# Altium schematic sheet demoboard.SchDoc
size A3; PageSetup: Record=PageOptions|CenterHorizontal=True|CenterVertical=True|PrintScale=0.73|XCorrection=1.00|YCorrection=1.00|PrintKind=0|BorderSize=5000000|LeftOffset=0|BottomOffset=0|Orientation=2|PaperLength=1000|PaperWidth=1000|Scale=100|PaperSource=7|PrintQuality=-3|MediaType=1|DitherType=10|PrintScaleMode=1|PaperKind=A4|PaperIndex=9
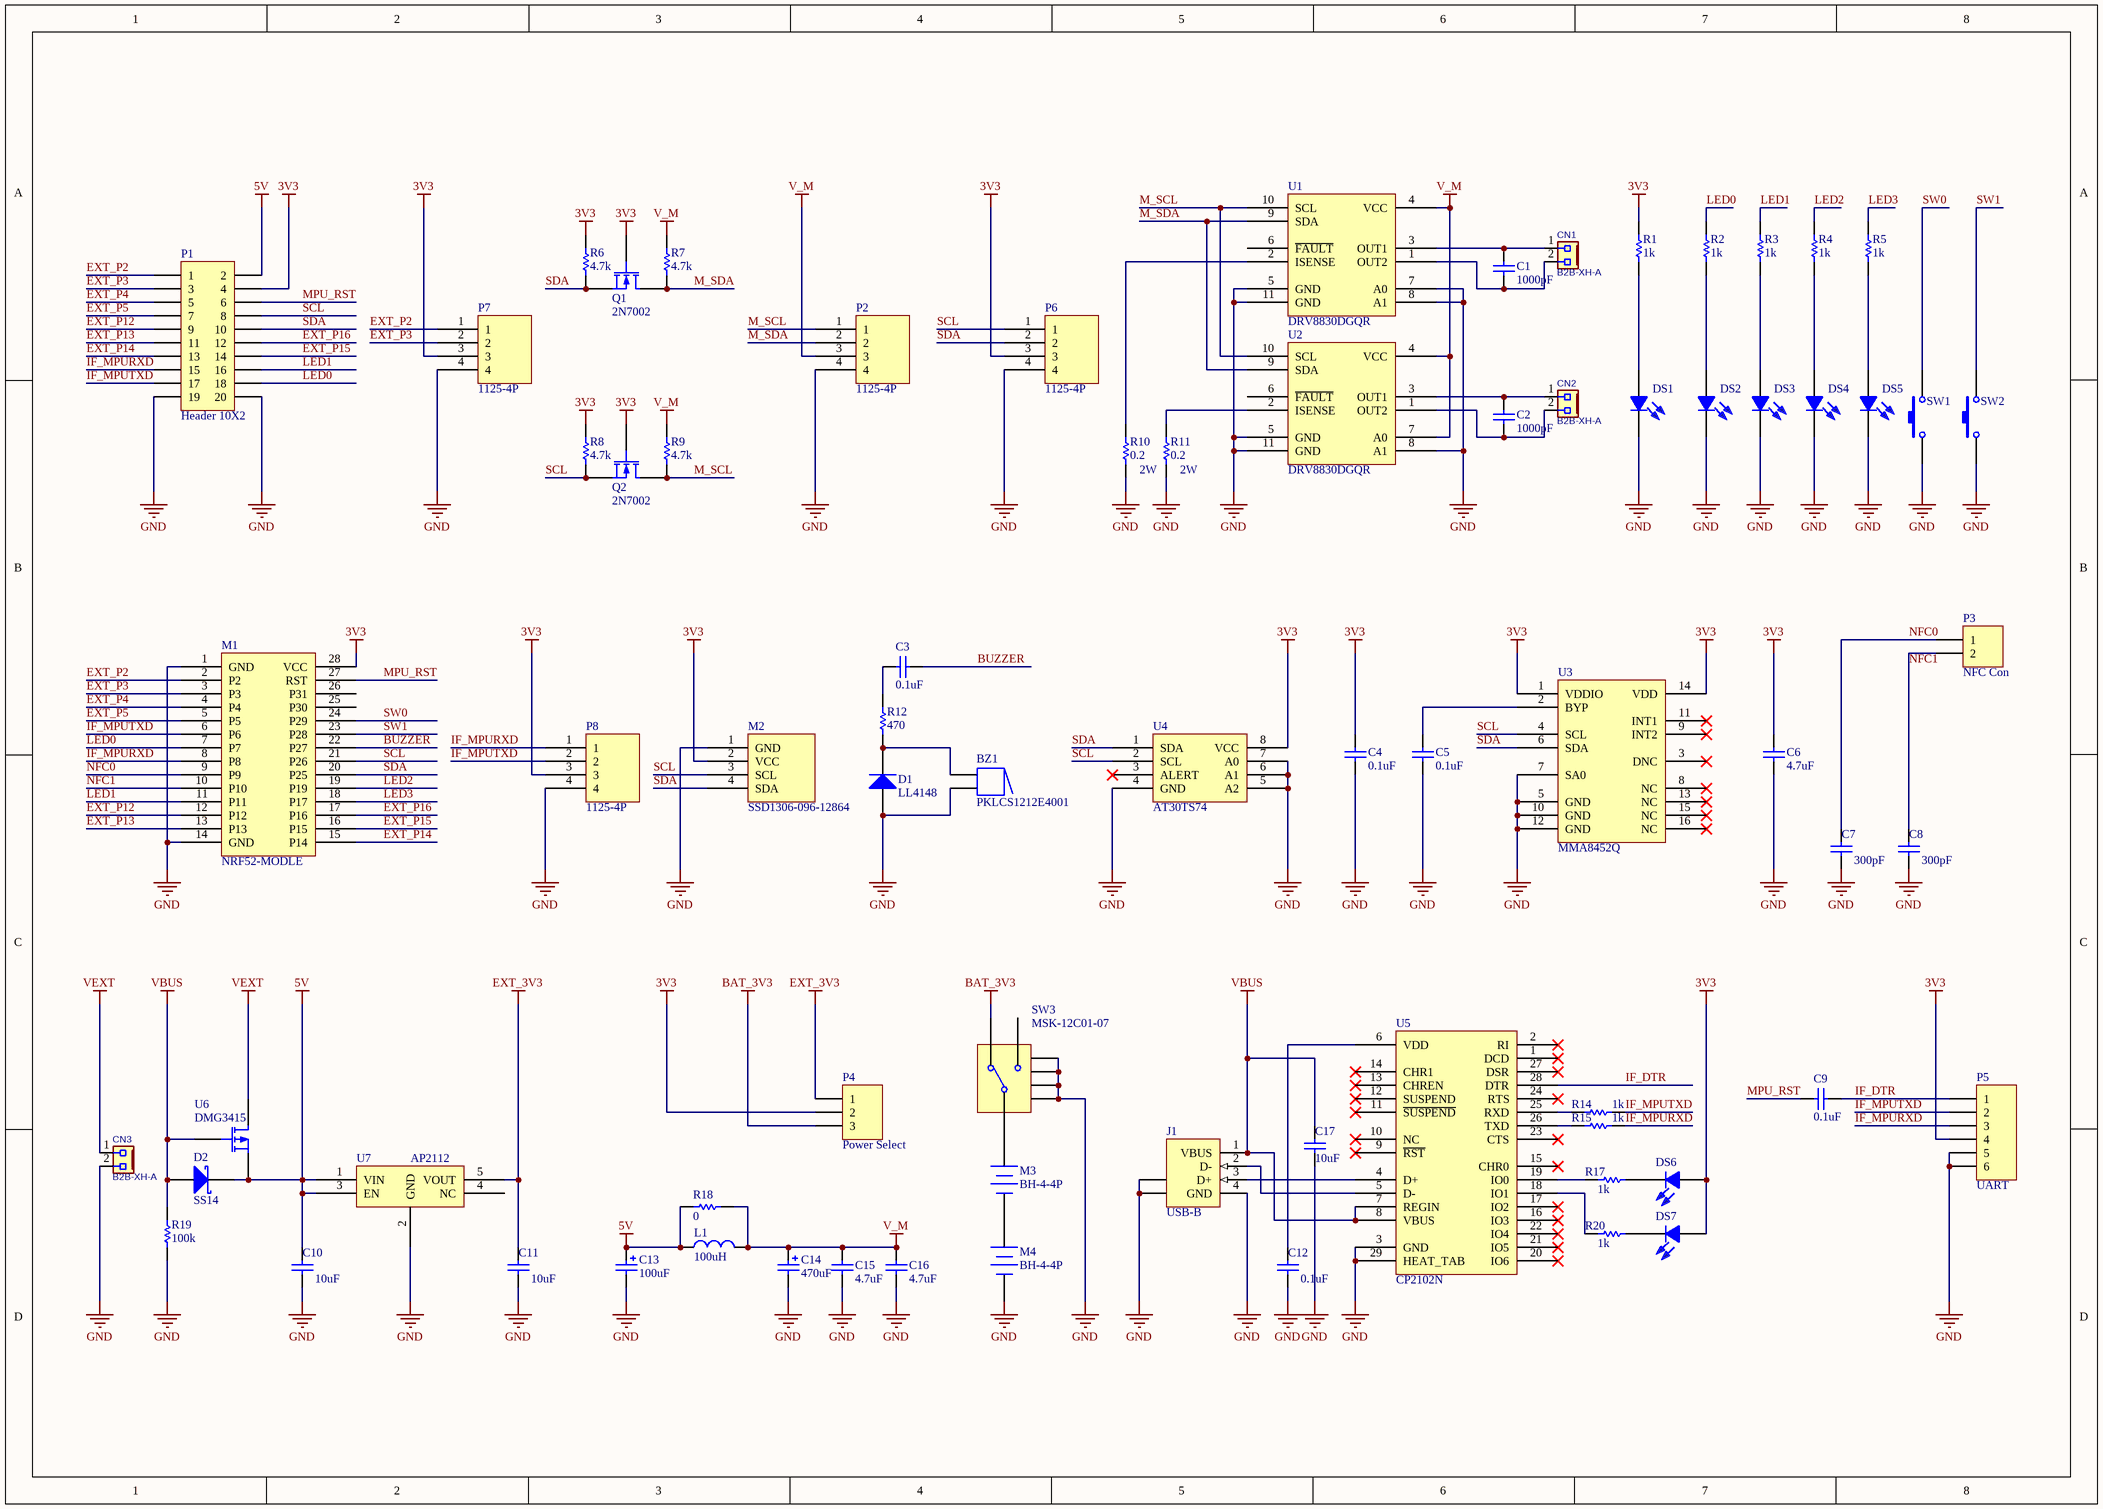
[diagram p0: demoboard.SchDoc]

## Parts
BZ1  PKLCS1212E4001  [PKLCS1212E4001]
C1  value 1000pF  [2012[0805]]  (hidden comment: Cap1)
C2  value 1000pF  [2012[0805]]  (hidden comment: Cap1)
C3  value 0.1uF  [2012[0805]]  (hidden comment: Cap1)
C4  value 0.1uF  [2012[0805]]  (hidden comment: Cap1)
C5  value 0.1uF  [2012[0805]]  (hidden comment: Cap1)
C6  value 4.7uF  [2012[0805]]  (hidden comment: Cap1)
C7  value 300pF  [2012[0805]]  (hidden comment: Cap1)
C8  value 300pF  [2012[0805]]  (hidden comment: Cap1)
C9  value 0.1uF  [2012[0805]]  (hidden comment: Cap1)
C10  value 10uF  [2012[0805]]  (hidden comment: Cap1)
C11  value 10uF  [2012[0805]]  (hidden comment: Cap1)
C12  value 0.1uF  [2012[0805]]  (hidden comment: Cap1)
C13  value 100uF  [CE04-8]  (hidden comment: Cap2)
C14  value 470uF  [CE04-8]  (hidden comment: Cap2)
C15  value 4.7uF  [2012[0805]]  (hidden comment: Cap1)
C16  value 4.7uF  [2012[0805]]  (hidden comment: Cap1)
C17  value 10uF  [2012[0805]]  (hidden comment: Cap1)
CN1  B2B-XH-A  [CND-B2B-XH-A]
CN2  B2B-XH-A  [CND-B2B-XH-A]
CN3  B2B-XH-A  [CND-B2B-XH-A]
D1  LL4148  [SOD80]
D2  SS14  [DO-214AC]
DS1  (no value)  [3216[1206]+A]
DS2  (no value)  [3216[1206]+A]
DS3  (no value)  [3216[1206]+A]
DS4  (no value)  [3216[1206]+A]
DS5  (no value)  [3216[1206]+A]
DS6  (no value)  [3216[1206]+A]
DS7  (no value)  [3216[1206]+A]
J1  USB-B  [USB-B-MICRO]
L1  value 100uH  [INDUCTOR-1212]  (hidden comment: Inductor)
M1  NRF52-MODLE  [NRF52-MODLE]
M2  SSD1306-096-12864  [SSD1306-096-12864]
M3  BH-4-4P  [BH-4-4P]
M4  BH-4-4P  [BH-4-4P]
P1  Header 10X2  [HDR2X10]
P2  1125-4P  [1125-4P]
P3  NFC Con  [HDR1X2]
P4  Power Select  [HDR1X3]
P5  UART  [HDR1X6]
P6  1125-4P  [1125-4P]
P7  1125-4P  [1125-4P]
P8  1125-4P  [1125-4P]
Q1  2N7002  [SOT23-3]
Q2  2N7002  [SOT23-3]
R1  value 1k  [2012[0805]]  (hidden comment: Res)
R2  value 1k  [2012[0805]]  (hidden comment: Res)
R3  value 1k  [2012[0805]]  (hidden comment: Res)
R4  value 1k  [2012[0805]]  (hidden comment: Res)
R5  value 1k  [2012[0805]]  (hidden comment: Res)
R6  value 4.7k  [2012[0805]]  (hidden comment: Res)
R7  value 4.7k  [2012[0805]]  (hidden comment: Res)
R8  value 4.7k  [2012[0805]]  (hidden comment: Res)
R9  value 4.7k  [2012[0805]]  (hidden comment: Res)
R10  value 0.2  [6332[2512]]  (hidden comment: Res)
R11  value 0.2  [6332[2512]]  (hidden comment: Res)
R12  value 470  [2012[0805]]  (hidden comment: Res)
R14  value 1k  [2012[0805]]  (hidden comment: Res)
R15  value 1k  [2012[0805]]  (hidden comment: Res)
R17  value 1k  [2012[0805]]  (hidden comment: Res)
R18  value 0  [2012[0805]]  (hidden comment: Res)
R19  value 100k  [2012[0805]]  (hidden comment: Res)
R20  value 1k  [2012[0805]]  (hidden comment: Res)
SW1  TL3342F160QG  [TL3342F160QG]  (value not drawn)
SW2  TL3342F160QG  [TL3342F160QG]  (value not drawn)
SW3  MSK-12C01-07  [MSK-12C01-07]
U1  DRV8830DGQR  [MSOP10TPH]
U2  DRV8830DGQR  [MSOP10TPH]
U3  MMA8452Q  [QFN16S-0.5]
U4  AT30TS74  [SOIC8]
U5  CP2102N  [QFN28-0.5]
U6  DMG3415  [SOT23-3]
U7  AP2112  [SOT23-5]

## Nets
3V3: C4.1 C6.1 DS6.1 DS7.1 M1.28(VCC) M2.2(VCC) P1.4 P4.2 P5.4 P6.3 P7.3 P8.3 Q1.1(G) Q2.1(G) R1.1 R6.1 R8.1 U3.1(VDDIO) U3.14(VDD) U4.8(VCC)
5V: C10.2 C13.1 D2.2(K) L1.1 P1.2 R18.1 U6.2(S) U7.1(VIN) U7.3(EN)
BAT_3V3: P4.3 SW3.1
EXT_3V3: C11.2 P4.1 U7.5(VOUT)
GND: BZ1.2 C4.2 C5.2 C6.2 C7.1 C8.1 C10.1 C11.1 C12.1 C13.2 C14.2 C15.2 C16.2 C17.1 CN3.2 D1.1(A) DS1.2 DS2.2 DS3.2 DS4.2 DS5.2 J1.4(GND) J1.5(SHLD) J1.6(SHLD) M1.1(GND) M1.14(GND) M2.1(GND) M4.2(-) P1.19 P1.20 P2.4 P5.5 P5.6 P6.4 P7.4 P8.4 R10.1 R11.1 R19.1 SW1.1 SW2.1 SW3.4 SW3.5 SW3.6 SW3.7 U1.5(GND) U1.7(A0) U1.8(A1) U1.11(GND) U2.5(GND) U2.8(A1) U2.11(GND) U3.5(GND) U3.7(SA0) U3.10(GND) U3.12(GND) U4.4(GND) U4.5(A2) U4.6(A1) U4.7(A0) U5.3(GND) U5.29(HEAT_TAB) U7.2(GND)
V_M: C14.1 C15.1 C16.1 L1.2 P2.3 R7.2 R9.2 R18.2 U1.4(VCC) U2.4(VCC) U2.7(A0)
VBUS: C17.2 D2.1(A) J1.1(VBUS) R19.2 U5.7(REGIN) U5.8(VBUS) U6.1(G)
VEXT: CN3.1 U6.3(D)
BUZZER: C3.2 M1.22(P27)
EXT_P2: M1.2(P2) P1.1 P7.1
EXT_P3: M1.3(P3) P1.3 P7.2
EXT_P4: M1.4(P4) P1.5
EXT_P5: M1.5(P5) P1.7
EXT_P12: M1.12(P12) P1.9
EXT_P13: M1.13(P13) P1.11
EXT_P14: M1.15(P14) P1.13
EXT_P15: M1.16(P15) P1.14
EXT_P16: M1.17(P16) P1.12
IF_DTR: C9.1 P5.1 U5.28(DTR)
IF_MPURXD: M1.8(P8) P1.15 P5.3 P8.1 R15.2
IF_MPUTXD: M1.6(P6) P1.17 P5.2 P8.2 R14.2
LED0: M1.7(P7) P1.18 R2.1
LED1: M1.11(P11) P1.16 R3.1
LED2: M1.19(P19) R4.1
LED3: M1.18(P17) R5.1
M_SCL: P2.1 Q2.3(D) R9.1 U1.10(SCL) U2.10(SCL)
M_SDA: P2.2 Q1.3(D) R7.1 U1.9(SDA) U2.9(SDA)
MPU_RST: C9.2 M1.27(RST) P1.6
NFC0: C7.2 M1.9(P9) P3.1
NFC1: C8.2 M1.10(P10) P3.2
SCL: M1.21(P26) M2.3(SCL) P1.8 P6.1 Q2.2(S) R8.2 U3.4(SCL) U4.2(SCL)
SDA: M1.20(P25) M2.4(SDA) P1.10 P6.2 Q1.2(S) R6.2 U3.6(SDA) U4.1(SDA)
SW0: M1.24(P29) SW1.3
SW1: M1.23(P28) SW2.3
NetBZ1_1: BZ1.1 D1.2(K) R12.1
NetC1_1: C1.1 CN1.1 U1.3(OUT1)
NetC1_2: C1.2 CN1.2 U1.1(OUT2)
NetC2_1: C2.1 CN2.1 U2.3(OUT1)
NetC2_2: C2.2 CN2.2 U2.1(OUT2)
NetC3_1: C3.1 R12.2
NetC5_1: C5.1 U3.2(BYP)
NetC12_2: C12.2 U5.6(VDD)
NetDS1_1: DS1.1 R1.2
NetDS2_1: DS2.1 R2.2
NetDS3_1: DS3.1 R3.2
NetDS4_1: DS4.1 R4.2
NetDS5_1: DS5.1 R5.2
NetDS6_2: DS6.2 R17.1
NetDS7_2: DS7.2 R20.1
NetJ1_2: J1.2(D-) U5.5(D-)
NetJ1_3: J1.3(D+) U5.4(D+)
NetM3_1: M3.1(+) SW3.2
NetM3_2: M3.2(-) M4.1(+)
NetR10_2: R10.2 U1.2(ISENSE)
NetR11_2: R11.2 U2.2(ISENSE)
NetR14_1: R14.1 U5.25(RXD)
NetR15_1: R15.1 U5.26(TXD)
NetR17_2: R17.2 U5.19(IO0)
NetR20_2: R20.2 U5.18(IO1)

Not connected (* = marked no-connect by the designer): M1 25(P30) 26(P31); SW3 3; U1 6(~{FAULT}); U2 6(~{FAULT}); U3 3(DNC)* 8(NC)* 9(INT2)* 11(INT1)* 13(NC)* 15(NC)* 16(NC)*; U4 3(ALERT)*; U5 1(DCD)* 2(RI)* 9(~{RST})* 10(NC)* 11(~{SUSPEND})* 12(SUSPEND)* 13(CHREN)* 14(CHR1)* 15(CHR0)* 16(IO3)* 17(IO2)* 20(IO6)* 21(IO5)* 22(IO4)* 23(CTS)* 24(RTS)* 27(DSR)*; U7 4(NC)

## Notes on the sheet
- (in symbol Res) 2W

## Library data of the parts
CN1-CN3 = B2B-XH-A: XHシリーズ ベース付ポスト トップ型 2.5mmピッチ　250V 3A; Manufactuer: 日本圧着端子¦; Manufactuer P/N: B2B-XH-A; HelpURL: http://www.jst-mfg.com/index_j.php
DS1-DS7 = LED: color: red
J1 = USB-B: USB 1.1, Right Angle, Thru-Hole, B Type, Receptacle, 4 Position, White; ContactMaterial: Phosphor Bronze; ContactPlating: Gold over Nickel; TerminationLength: 3.00mm [0.118in.]; PCB_Layout: Complies with manufacturer's recommendation.; DrillSize: Corresponds to nominal value.; PanelGround: Without; Published: 15-Jul-2004; DatasheetDocument: 02-Jun-2001; PackageDocument: 02-Jun-2001; PackageReference: 1-1470156; Publisher: Altium Limited; HousingMaterial: Glass-Filled Thermoplastic; ComponentLink1Description: Manufacturer Link; ComponentLink1URL: http://www.tycoelectronics.com/; ComponentLink2Description: Packaging Specification; ComponentLink2URL: http://ecommas.tycoelectronics.com/commerce/DocumentDelivery/DDEController?Action=showdoc&DocId=Customer+Drawing%7F1470156%7FO%7Ftif%7FEnglish%7FC_1470156_O.tif
P1 = Header 10X2: Header, 10-Pin, Dual row; LatestRevisionDate: 17-Jul-2002; LatestRevisionNote: Re-released for DXP Platform.; Publisher: Altium Limited
P2 P6-P8 = 1125-4P: Seed Studio Grobe connector
P3 = Header 2: Header, 2-Pin; LatestRevisionDate: 17-Jul-2002; LatestRevisionNote: Re-released for DXP Platform.; Publisher: Altium Limited
P4 = Header 3: Header, 3-Pin; LatestRevisionDate: 17-Jul-2002; LatestRevisionNote: Re-released for DXP Platform.; Publisher: Altium Limited
P5 = Header 6: Header, 6-Pin; LatestRevisionDate: 17-Jul-2002; LatestRevisionNote: Re-released for DXP Platform.; Publisher: Altium Limited
Q1 Q2 = 2N7002: N-Channel MOSFET
U3 = MMA8452Q: MMA8452AQ
U5 = CP2102N: PART DESC: SINGLE-CHIP USB TO UART BRIDGE, QFN28, RoHS.; PART NUMBER: CP2102; MFG #1: SILICON LABS; Value: Value; RefDes: RefDes; Type: DEV
U6 = DMG3415: Published: 8-Jun-2000; LatestRevisionDate: 17-Jul-2002; LatestRevisionNote: Re-released for DXP Platform.; PackageVersion: 1995/1996; PackageReference: E3; Publisher: Altium Limited; PackageDescription: TO, Flat Index; 3 In-Line, Axial Leads; Body Dia. 4.6mm; Lead Dia. 0.5 mm (max)